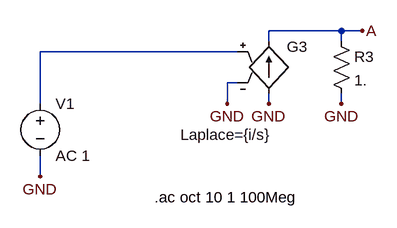
[diagram p0: schematic icplx.asc]
icplx.asc, the LTspice schematic file:
Version 4
SHEET 1 1540 912
WIRE 896 272 896 192
WIRE 896 352 896 384
WIRE 1248 272 1248 256
WIRE 1360 272 1360 256
WIRE 1248 176 1248 160
WIRE 1248 160 1360 160
WIRE 1360 160 1360 176
WIRE 1200 240 1184 240
WIRE 1184 240 1184 272
WIRE 1360 160 1392 160
WIRE 1200 192 896 192
FLAG 896 384 GND
FLAG 1360 272 GND
FLAG 1248 272 GND
FLAG 1184 272 GND
FLAG 1392 160 A
SYMBOL voltage 896 256 R0
SYMATTR InstName V1
SYMATTR Value AC 1
SYMBOL g 1248 160 R0
WINDOW 0 28 24 Left 0
WINDOW 3 -136 160 Left 0
SYMATTR InstName G3
SYMATTR Value Laplace={i/s}
SYMBOL res 1344 160 R0
SYMATTR InstName R3
SYMATTR Value 1.
TEXT 1072 416 Left 0 !.ac oct 10 1 100Meg

The netlist it stands for:
* icplx.asc
V1 N001 GND AC 1
G3 GND A N001 GND Laplace={i/s}
R3 A GND 1.
.ac oct 10 1 100Meg
.backanno
.end